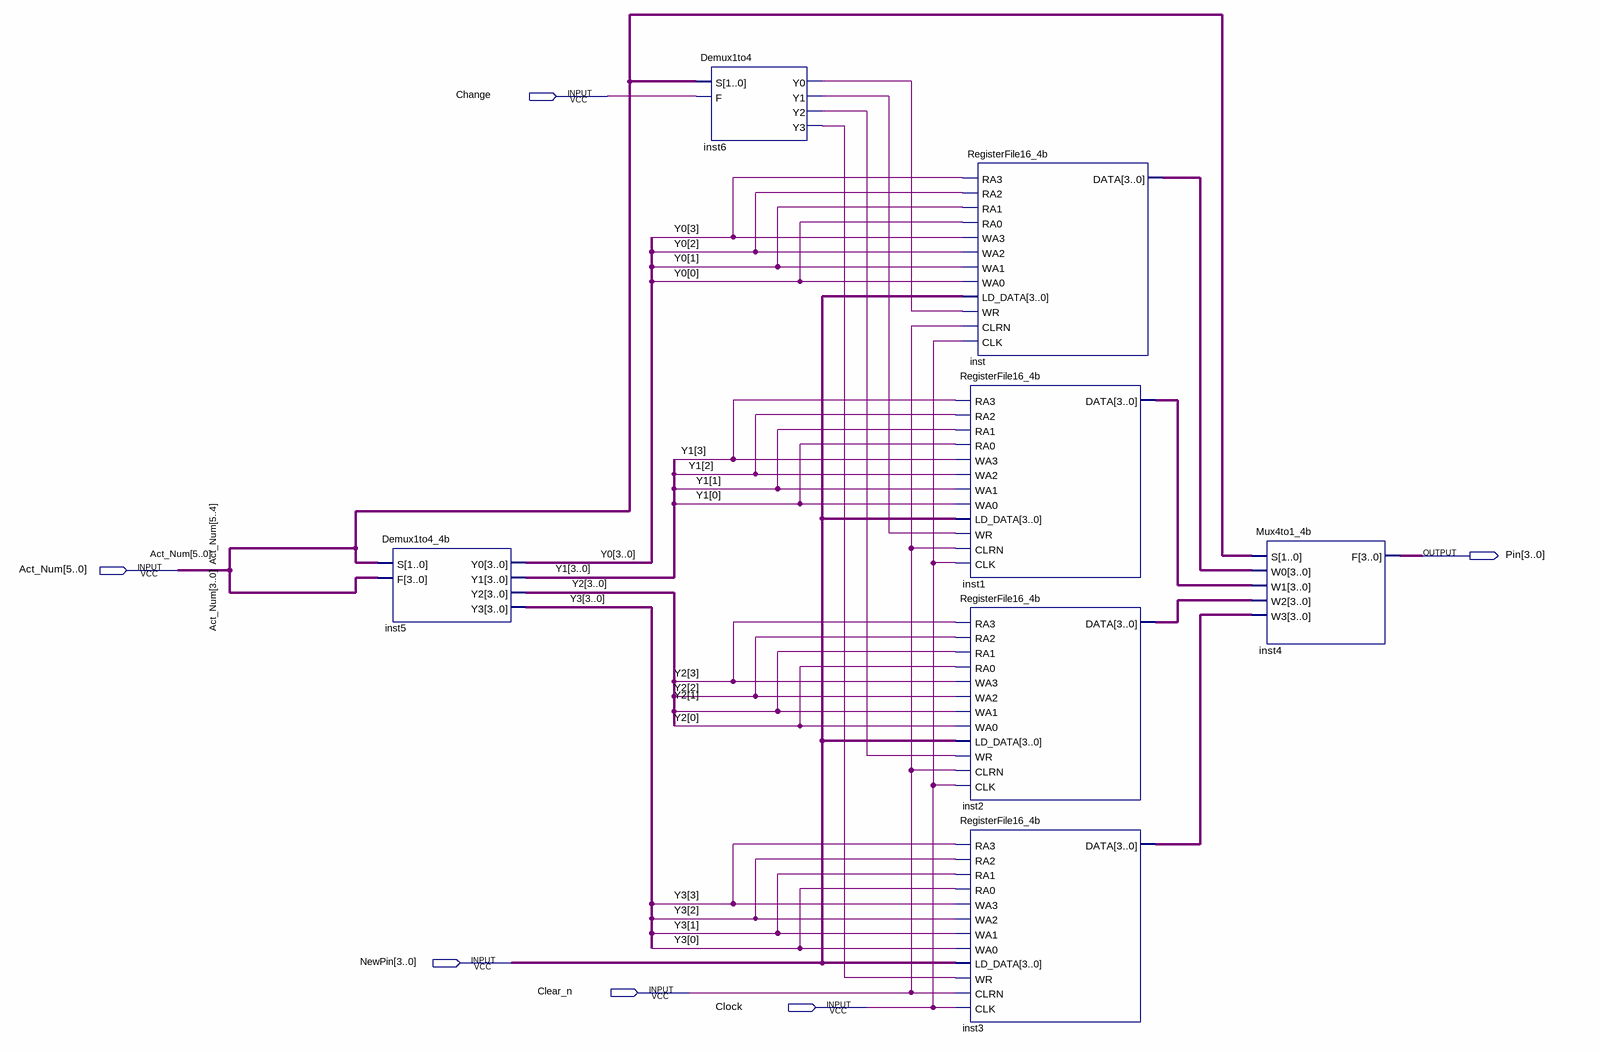
[diagram p0: schematic sheet]
// Quartus schematic AccountPins.bdf as structural Verilog: 7 symbols, 6 pins
module AccountPins (
  input  Change,
  input  [5:0] Act_Num,
  input  [3:0] NewPin,
  input  Clear_n,
  input  Clock,
  output [3:0] Pin
);

  wire inst6_y0, inst6_y1, inst6_y2, inst6_y3;
  wire [3:0] inst1_data, inst2_data, inst3_data, inst_data, Y0, Y1, Y2, Y3;

  Demux1to4_4b inst5 (.S(Act_Num[5:4]), .F(Act_Num[3:0]), .Y0(Y0), .Y1(Y1), .Y2(Y2), .Y3(Y3));
  Demux1to4 inst6 (.S(Act_Num[5:4]), .F(Change), .Y0(inst6_y0), .Y1(inst6_y1), .Y2(inst6_y2), .Y3(inst6_y3));
  RegisterFile16_4b inst (
    .RA3(Y0[3]), .RA2(Y0[2]), .RA1(Y0[1]), .RA0(Y0[0]), .WA3(Y0[3]), .WA2(Y0[2]), .WA1(Y0[1]), .WA0(Y0[0]),
    .LD_DATA(NewPin), .WR(inst6_y0), .CLRN(Clear_n), .CLK(Clock), .DATA(inst_data));
  RegisterFile16_4b inst1 (
    .RA3(Y1[3]), .RA2(Y1[2]), .RA1(Y1[1]), .RA0(Y1[0]), .WA3(Y1[3]), .WA2(Y1[2]), .WA1(Y1[1]), .WA0(Y1[0]),
    .LD_DATA(NewPin), .WR(inst6_y1), .CLRN(Clear_n), .CLK(Clock), .DATA(inst1_data));
  RegisterFile16_4b inst2 (
    .RA3(Y2[3]), .RA2(Y2[2]), .RA1(Y2[1]), .RA0(Y2[0]), .WA3(Y2[3]), .WA2(Y2[2]), .WA1(Y2[1]), .WA0(Y2[0]),
    .LD_DATA(NewPin), .WR(inst6_y2), .CLRN(Clear_n), .CLK(Clock), .DATA(inst2_data));
  RegisterFile16_4b inst3 (
    .RA3(Y3[3]), .RA2(Y3[2]), .RA1(Y3[1]), .RA0(Y3[0]), .WA3(Y3[3]), .WA2(Y3[2]), .WA1(Y3[1]), .WA0(Y3[0]),
    .LD_DATA(NewPin), .WR(inst6_y3), .CLRN(Clear_n), .CLK(Clock), .DATA(inst3_data));
  Mux4to1_4b inst4 (.S(Act_Num[5:4]), .W0(inst_data), .W1(inst1_data), .W2(inst2_data), .W3(inst3_data), .F(Pin));
endmodule
